# EAGLE design v4MetroKnome (EAGLE 6.1)
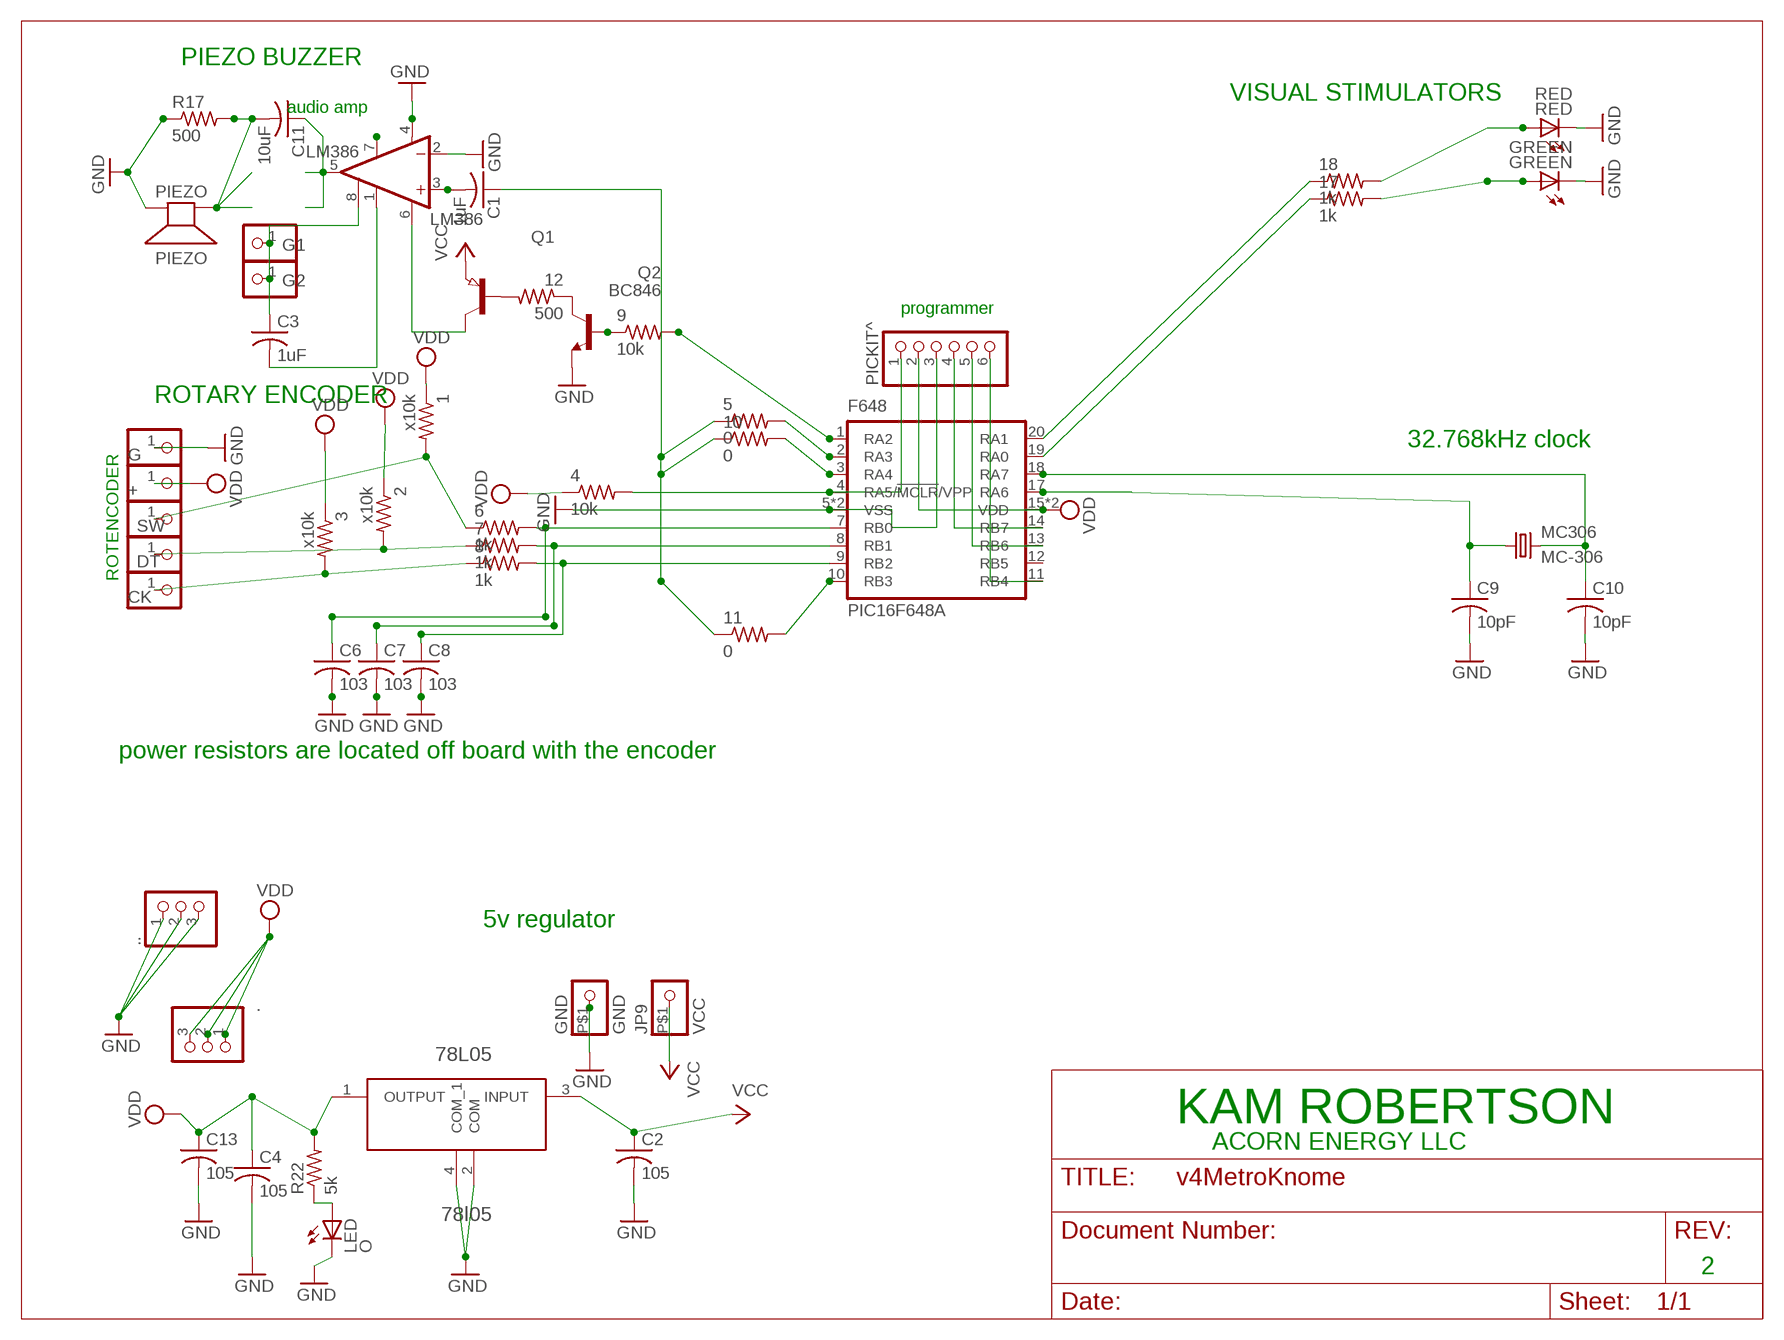
[diagram p0: schematic, sheet 1]

## Parts
1  x10k  R-US_R1206  [R1206]
2  x10k  R-US_R1206  [R1206]
3  x10k  R-US_R1206  [R1206]
4  10k  R-US_R1206  [R1206]
5  0  R-US_R1206  [R1206]
6  1k  R-US_R1206  [R1206]
7  1k  R-US_R1206  [R1206]
8  1k  R-US_R1206  [R1206]
9  10k  R-US_R1206  [R1206]
10  0  R-US_R1206  [R1206]
11  0  R-US_R1206  [R1206]
12  500  R-US_R1206  [R1206]
17  1k  R-US_R1206  [R1206]
18  1k  R-US_R1206  [R1206]
78L05  78l05  UA78L05ACPKG3  [SOT150P400X160-4N]
+  PINHD-1X1CB  [1X01-CLEANBIG]
.  PINHD-1X3CB  [1X03-CLEANBIG]
..  PINHD-1X3CB  [1X03-CLEANBIG]
C1  1uF  C-USC1210  [C1210]
C2  105  C-USC1210  [C1210]
C3  1uF  C-USC1210  [C1210]
C4  105  C-USC1210  [C1210]
C6  103  C-USC1210  [C1210]
C7  103  C-USC1210  [C1210]
C8  103  C-USC1210  [C1210]
C9  10pF  C-USC1210  [C1210]
C10  10pF  C-USC1210  [C1210]
C11  10uF  C-USC1210  [C1210]
C13  105  C-USC1210  [C1210]
CK  PINHD-1X1CB  [1X01-CLEANBIG]
DT  PINHD-1X1CB  [1X01-CLEANBIG]
F648  PIC16F648A  PIC16F1826/27SS  [SSOP20]
G  PINHD-1X1CB  [1X01-CLEANBIG]
G1  PINHD-1X1CB  [1X01-CLEANBIG]
G2  PINHD-1X1CB  [1X01-CLEANBIG]
GND  GND  PINHD-1X1-BIGPOGO  [1X1-BIGPOGO]
GREEN  GREEN  LED5MM  [LED5MM]
JP9  VCC  PINHD-1X1-BIGPOGO  [1X1-BIGPOGO]
LED  O  LEDCHIPLED_1206  [CHIPLED_1206]
LM386  LM386  LM386M-1  [SO08]
MC306  MC-306  [MC-306]
PICKIT^  PINHD-1X6LOCK  [1X06-BIGLOCK]
PIEZO  PIEZO  SPEAKER/PS12  [PS12]
Q1  PNP-TRANSISTOR_SOT89  [SOT89]
Q2  BC846  [SOT23]
R17  500  R-US_R1206  [R1206]
R22  5k  R-US_R1206  [R1206]
RED  RED  LED5MM  [LED5MM]
SW  PINHD-1X1CB  [1X01-CLEANBIG]

## Nets
GND: 78L05.2(COM) 78L05.4(COM_1) ...1 ...2 ...3 C2.2 C4.2 C6.2 C7.2 C8.2 C9.2 C10.2 C13.2 F648.5(VSS) F648.6(VSS) G.1 GND.P$1 GREEN.K(C) LED.C LM386.2(-IN) LM386.4(GND) PICKIT^.3 PIEZO.P$2(-) Q2.2(E) R17.1 RED.K(C)
N$1: 9.2 F648.1(RA2)
N$2: C3.2 LM386.1(GAIN)
N$3: 9.1 Q2.1(B)
N$4: 5.2 F648.2(RA3)
N$5: 4.2 F648.4(RA5/!MCLR!/VPP) PICKIT^.1
N$6: 6.2 C6.1 F648.7(RB0)
N$7: 7.2 C7.1 F648.8(RB1)
N$8: 8.2 C8.1 F648.9(RB2)
N$9: 10.2 F648.3(RA4)
N$10: 11.2 F648.10(RB3)
N$11: 12.1 Q2.3(C)
N$12: 12.2 Q1.1(B)
N$13: C3.1 G1.1 G2.1 LM386.8(GAIN)
N$14: 1.2 6.1 SW.1
N$15: 2.2 7.1 DT.1
N$16: 3.2 8.1 CK.1
N$18: 18.1 F648.20(RA1)
N$19: 17.1 F648.19(RA0)
N$22: F648.14(RB7) PICKIT^.4
N$24: F648.13(RB6) PICKIT^.5
N$27: F648.11(RB4) PICKIT^.6
N$28: 18.2 RED.A
N$29: 17.2 GREEN.A
N$31: C9.1 F648.17(RA6) MC306.1
N$35: C1.2 LM386.3(+IN)
N$36: C11.1 LM386.5(OUT)
N$37: C10.1 F648.18(RA7) MC306.4
N$39: C11.2 PIEZO.P$1(+) R17.2
N$40: LED.A R22.1
N$85: 5.1 10.1 11.1 C1.1
N$102: LM386.7(BYPASS)
VCC: 78L05.3(INPUT) C2.1 JP9.P$1 Q1.3(E)
VDD: 1.1 2.1 3.1 4.1 78L05.1(OUTPUT) +.1 ..1 ..2 ..3 C4.1 C13.1 F648.15(VDD) F648.16(VDD) PICKIT^.2 R22.2
VS: LM386.6(VS) Q1.2(C)
Unconnected: F648.12(RB5)

## Notes on the sheet
- PIEZO BUZZER
- audio amp | VISUAL STIMULATORS
- programmer
- ROTARY ENCODER
- 32.768kHz clock
- ROTENCODER
- power resistors are located off board with the encoder
- 5v regulator
- KAM ROBERTSON
- ACORN ENERGY LLC
- 2

## Library data of the parts
1-12 17 18 R17 R22 = resistor:R-US_: RESISTOR, American symbol
78L05 = TI-Eagle_library:UA78L05: μA78L00 SERIES POSITIVE-VOLTAGE REGULATORS,SOT-89-3; MPN: UA78L05ACPKG3; OC_FARNELL: 1236590; OC_NEWARK: 13M5626; PACKAGE: SOT-89-3; SUPPLIER: TEXAS INSTRUMENTS
+ CK DT G G1 G2 GND JP9 SW = adafruit:PINHD-1X1: Pin header 1x1 for 0.1" spacing With round pins
. .. = adafruit:PINHD-1X3: PIN HEADER
C1-C4 C6-C11 C13 = adafruit:C-US: CAPACITOR, American symbol
F648 = microchip:PIC16*F1826/27: 18/20/28-Pin Flash Microcontrollers with nanoWatt XLP Technology Source: www.microchip.com PIC16F1827.pdf
GREEN LED RED = adafruit:LED: LED OSRAM: - CHIPLED LG R971, LG N971, LY N971, LG Q971, LY Q971, LO R971, LY R971 LH N974, LH R974 LS Q976, LO Q976, LY Q976 LO Q996 - Hyper CHIPLED LW Q18S LB Q993, LB Q99A, LB R99A - SideLED LS A670, LO A670, LY A670, LG A670, LP A670 LB A673, LV A673, LT A673, LW A673 LH A674 LY A675 LS A676, LA A676, LO A676, LY A676, LW A676 LS A679, LY A679, LG A679 - Hyper Micro SIDELED® LS Y876, LA Y876, LO Y876, LY Y876 LT Y87S - SmartLED LW L88C, LW L88S LB L89C, LB L89S, LG L890 LS L89K, LO L89K, LY L89K LS L896, LA L896, LO L896, LY L896 - TOPLED LS T670, LO T670, LY T670, LG T670, LP T670 LSG T670, LSP T670, LSY T670, LOP T670, LYG T670 LG T671, LOG T671, LSG T671 LB T673, LV T673, LT T673, LW T673 LH T674 LS T676, LA T676, LO T676, LY T676, LB T676, LH T676, LSB T676, LW T676 LB T67C, LV T67C, LT T67C, LS T67K, LO T67K, LY T67K, LW E67C LS E67B, LA E67B, LO E67B, LY E67B, LB E67C, LV E67C, LT E67C LW T67C LS T679, LY T679, LG T679 LS T770, LO T770, LY T770, LG T770, LP T770 LB T773, LV T773, LT T773, LW T773 LH T774 LS E675, LA E675, LY E675, LS T675 LS T776, LA T776, LO T776, LY T776, LB T776 LHGB T686 LT T68C, LB T68C - Hyper Mini TOPLED® LB M676 - Mini TOPLED Santana® LG M470 LS M47K, LO M47K, LY M47K Source: http://www.osram.convergy.de/
LM386 = linear:LM386?-*: Low Voltage Audio Power Amplifier Source: http://cache.national.com/ds/LM/LM386.pdf
MC306 = crystal:MC-306: kHz RANGE CRYSTAL UNIT SMD Source: MC-306_405_406_E07X.PDF Homepage <http://www.epsontoyocom.co.jp>; MPN: MC-306 60.0KHZ 100PPM ,12.5PF; OC_FARNELL: 1278040; OC_NEWARK: 31M5576
PICKIT^ = adafruit:PINHD-1X6: PIN HEADER
PIEZO = adafruit:SPEAKER: SPEAKER Source: Buerklin Added PS12 (for part # PS1240 piezo) http://www.ladyada.net/library/pcb/eaglelibrary.html
Q1 = semicon-smd-ipc:PNP-TRANSISTOR_: PNP TRANSISTOR
Q2 = transistor-neu-to92:BC846: NPN TRANSISTOR

## Board
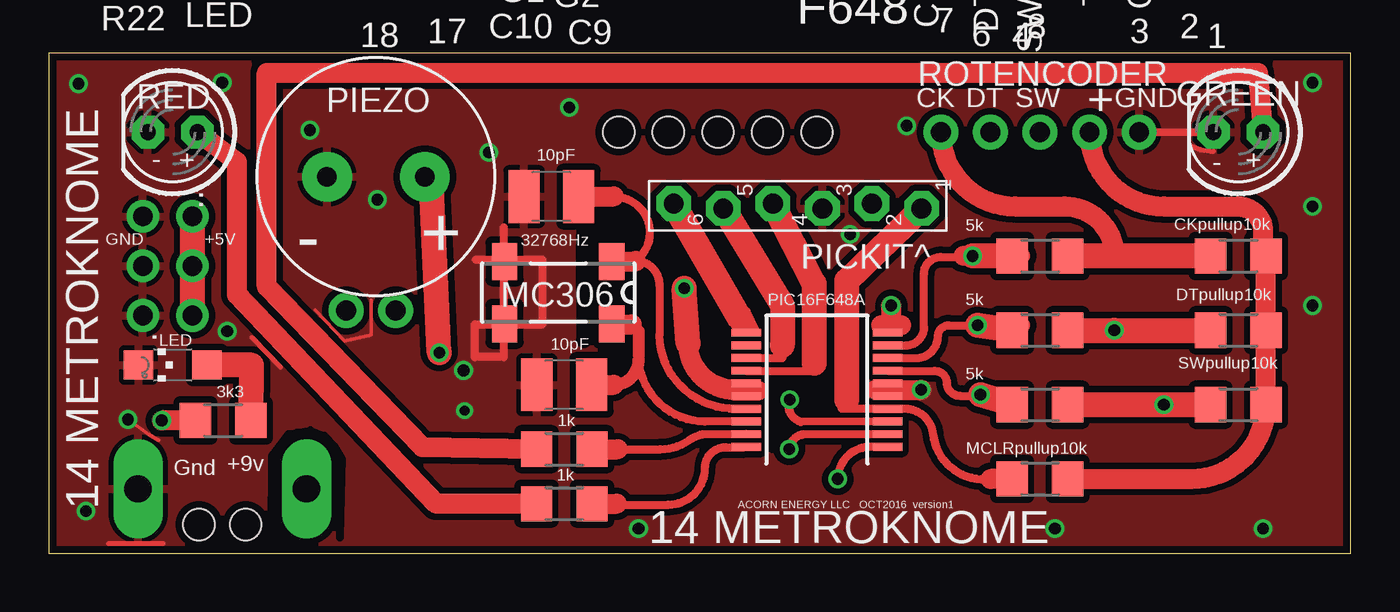
[diagram p1: board, top side]
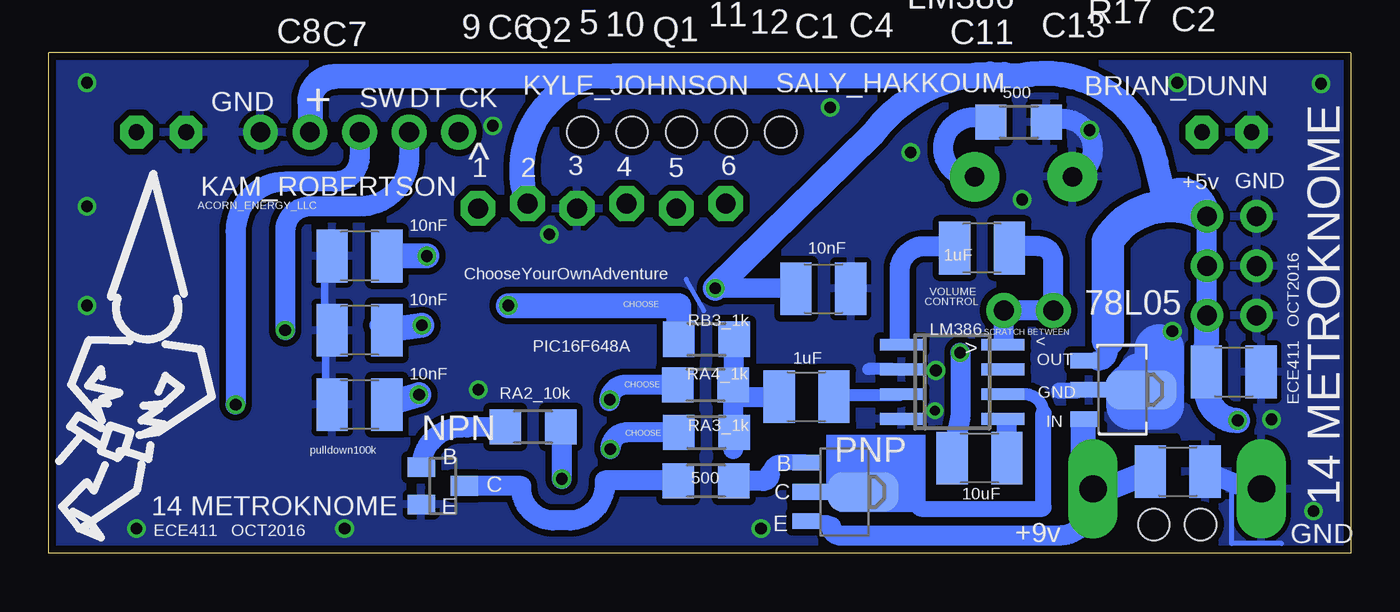
[diagram p2: board, bottom side, seen from below]

Size 66.73 x 25.65 mm. Coordinates in mm from the lower left corner, seen from the top.
Outline: 0,25.64 0,0
Outline: 0.01,0 66.73,0 66.73,25.65 0.01,25.65
Copper layers (1*16): Top 0.0356mm / dielectric 1.5011mm / Bottom 0.0356mm
Design rules: minimum track width 6mil, minimum drill 13mil, track to track 13mil, track to pad 13mil, pad to pad 13mil, via to via 13mil, smd to smd 13mil, copper to edge 15mil, drill to drill 6mil, minimum pad ring 7mil, minimum via ring 7mil, stop-mask expansion 2.5mil, vias tented up to drill 0mil, thermal gap 10mil
Holes 1.6 mm at 10.08,1.47 7.7,1.47 39.37,21.59 36.83,21.59 34.29,21.59 31.75,21.59 29.21,21.59
tRestrict: 14 lines
bRestrict: 5 lines

### Footprints (pad centres in the part's own frame; a part is rotated, then mirrored left to right if it is on the bottom)
R1206 = smd 1.6 x 1.803: 1 -1.422,0; 2 1.422,0
SOT150P400X160-4N = smd 0.8 x 1.4: 1 -1.499,-1.981; 3 1.499,-1.981 | smd 0.8 x 1.9: 2 0,-1.727 | smd 2.032 x 3.65: 4 0,0.94
1X01-CLEANBIG = drill 1.016 pad 1.778: 1 0,0
1X03-CLEANBIG = drill 1.016 pad 1.676: 1 -2.54,0; 2 0,0; 3 2.54,0
C1210 = smd 1.6 x 2.7: 1 -1.4,0; 2 1.4,0
SSOP20 = smd 0.4 x 1.5: 1 -2.925,-3.625; 2 -2.275,-3.625; 3 -1.625,-3.625; 4 -0.975,-3.625; 5 -0.325,-3.625; 6 0.325,-3.625; 7 0.975,-3.625; 8 1.625,-3.625; 9 2.275,-3.625; 10 2.925,-3.625; 11 2.925,3.625; 12 2.275,3.625; 13 1.625,3.625; 14 0.975,3.625; 15 0.325,3.625; 16 -0.325,3.625; 17 -0.975,3.625; 18 -1.625,3.625; 19 -2.275,3.625; 20 -2.925,3.625
1X1-BIGPOGO = drill 1.4 pad 2.54 long: P$1 0,0
LED5MM = drill 0.813 pad 1.676 octagon: A -1.27,0; K 1.27,0
CHIPLED_1206 = smd 1.5 x 1.5: A 0,-1.75; C 0,1.75
SO08 = smd 0.6 x 2.2: 1 -1.905,-2.6; 2 -0.635,-2.6; 3 0.635,-2.6; 4 1.905,-2.6; 5 1.905,2.6; 6 0.635,2.6; 7 -0.635,2.6; 8 -1.905,2.6
MC-306 = smd 1.3 x 1.9: 1 -2.75,-1.6; 2 2.75,-1.6; 3 2.75,1.6; 4 -2.75,1.6
1X06-BIGLOCK = drill 1.016 pad 1.778 octagon: 1 -6.35,0.127; 2 -3.81,-0.127; 3 -1.27,0.127; 4 1.27,-0.127; 5 3.81,0.127; 6 6.35,-0.127
PS12 = drill 1 pad 2.54: P$1 -2.5,0; P$2 2.5,0
SOT89 = smd 0.8 x 1.4: 1 -1.499,-1.981; 3 1.499,-1.981 | smd 0.8 x 1.9: 2 0,-1.727 | smd 2.032 x 3.65: 2@1 0,0.94
SOT23 = smd 1 x 1.4: 1 -0.95,-1.1; 2 0.95,-1.1; 3 0,1.1

### Placement (x,y rotation side)
1  60.96,7.62 180 top
2  60.96,11.43 180 top
3  60.96,15.24 180 top
4  50.8,3.81 180 top
5  33.02,6.2 180 bottom
6  50.8,7.62 180 top
7  50.8,11.43 180 top
8  50.8,15.24 180 top
9  41.91,6.48 0 bottom
10  33.07,8.64 180 bottom
11  33.02,10.97 180 bottom
12  33.05,3.71 0 bottom
17  26.42,5.33 180 top
18  26.42,2.54 180 top
78L05  11.68,8.38 270 bottom
+  53.34,21.59 90 top
.  7.37,14.73 90 top
..  4.83,14.73 270 top
C1  27.89,8.03 0 bottom
C2  8.86,4.19 0 bottom
C3  18.9,15.65 180 bottom
C4  27.03,13.56 0 bottom
C6  50.8,7.62 180 bottom
C7  50.8,11.43 180 bottom
C8  50.8,15.24 180 bottom
C9  25.76,18.29 180 top
C10  26.42,8.64 180 top
C11  19.02,4.88 180 bottom
C13  5.99,9.3 0 bottom
CK  45.72,21.59 90 top
DT  48.26,21.59 90 top
F648  39.37,8.38 90 top
G  55.88,21.59 90 top
G1  15.24,12.45 0 top
G2  17.78,12.45 0 top
GND  4.57,3.3 270 bottom
GREEN  60.96,21.59 180 top
JP9  13.21,3.3 90 bottom
LED  6.35,9.65 90 top
LM386  20.42,8.79 270 bottom
MC306  26.11,13.36 180 top
PICKIT^  38.38,17.81 180 top
PIEZO  16.76,19.3 180 top
Q1  25.93,3.15 270 bottom
Q2  46.53,3.45 270 bottom
R17  17.02,22.1 180 bottom
R22  8.94,6.81 180 top
RED  6.35,21.59 180 top
SW  50.8,21.59 90 top

### Tracks (layer width: path | path; a pad name or v marks a point on that pad's centre or on a via)
GND  (via drill 0.5, 0.6)
  Top 0.178: 5.64,5.79 5.13,6.1 v4.06,6.86 | 13.64,12.47 15.16,10.87 16.51,11.2 16.51,12.98
  Top 0.254: 10.41,11.05 11.86,9.55 | 58.5,20.9 59.03,20.7 59.69,20.6 | 3.05,0.51 5.84,0.51
  Top 0.381: G.1 GREEN.K | F648.5 43,8.08 43,8.69 F648.6
  Top 0.406: F648.5 42.99,8.38 42.42,8.38 | 23.32,16.71 23.32,10.06 21.84,10.06 21.84,11.73 25.3,11.73 25.3,15.04 21.89,15.04
  Top 1.016: 42.42,8.38 v44.7,8.38
  Bottom 0.254: 33.15,12.45 34.06,14.05 | 3.56,0.51 6.1,0.51 6.1,3.3
  Bottom 0.381: C6.2 52.53,8.28 52.53,11.68 C7.2 52.58,11.84 52.58,15.24 C8.2
  Bottom 0.61: 23.47,9.45 24.74,9.45
  Bottom 0.813: 14.07,8.38 14.07,8.33 14.94,8.33
  Bottom 1.016: 13.66,19.61 arc-169 15.65,22 arc249 15.65,22.1 arc-69 R17.1 | C2.2 4.57,3.05 GND.P$1
  Bottom 2.54: 9.8,10.46 9.8,7.59 11.28,7.59 11.28,8.48 10.74,8.48 10.74,9.02
  other vias: 8.89,24.13 16.84,18.14 22.56,20.55 41.07,16.36 64.77,12.7 51.56,1.27 62.23,1.27 64.77,24.13 64.77,17.78 1.52,24.08 1.91,2.16 21.31,7.32 43.97,21.92 26.67,22.86 30.23,1.27 21.26,9.37 13.39,21.69 9.14,11.38
  pour Top: 3.2,0.46 3.2,25.04 63.65,25.04 63.65,0.46
  pour Bottom: -0.15,25.45 66.6,25.45 66.6,-0.15 0.1,-0.15
  pour Top: 0.1,25.55 66.75,25.6 66.65,0.25 0.2,0.2
N$1  (via drill 0.6)
  Top 0.406: F648.1 42.13,5.46 arc90 v40.44,3.81
  Bottom 1.016: 9.2 40.44,6.48 v40.44,3.81
N$2
  Bottom 0.406: LM386.1 23.11,10.92
  Bottom 1.016: 23.11,10.92 23.11,14.48 arc90 21.84,15.75 20.57,15.75 arc90 20.32,15.49 | 20.32,15.49 20.32,15.75 | C3.2 20.3,15.52 arc90 20.32,15.49
N$3
  Bottom 1.016: 9.1 45.28,6.45 45.59,6.45 arc-90 Q2.1
N$4  (via drill 0.6)
  Top 0.381: 42.98,6.1 F648.2
  Top 0.406: 42.98,6.1 38.86,6.1 arc90 v37.95,5.33
  Bottom 1.016: 5.2 37.08,6.2 arc-90 v37.95,5.33
N$5
  Top 0.406: 40.89,7.87 40.64,7.41 F648.4 43.75,7.41 arc-90 45.31,6.1 arc90 48.26,3.81
  Top 1.016: 4.2 48.26,3.81
  Top 1.27: PICKIT^.1 40.89,13.97 40.89,7.87
N$6  (via drill 0.6)
  Top 0.406: v47.75,8.13 47.75,8.08 46.69,8.08 arc-90 46.02,8.74 arc90 45.41,9.35 43.01,9.35 arc-90 F648.7
  Top 1.27: 6.2 v47.75,8.13
  Bottom 1.27: v47.75,8.13 C6.1
N$7  (via drill 0.6)
  Top 0.406: F648.8 44.45,10.01 arc90 45.57,11.12 arc-90 46.13,11.68 v47.6,11.68
  Top 0.813: 49.89,11.68 7.2
  Top 1.27: 7.2 v47.6,11.68
  Bottom 0.813: C7.1 49.89,11.68
  Bottom 1.27: v47.6,11.68 C7.1
N$8  (via drill 0.6)
  Top 0.406: F648.9 43.93,10.66 arc90 44.86,11.58 44.86,14.33 arc-90 45.72,15.19 47.35,15.19 v47.35,15.24
  Top 0.813: 49.89,15.24 8.2
  Top 1.016: v47.35,15.24 46.89,15.24
  Top 1.27: 8.2 v47.35,15.24
  Bottom 1.27: v47.35,15.24 C8.1
N$9  (via drill 0.6)
  Top 0.406: F648.3 38.53,6.73 arc-90 v37.97,7.87
  Bottom 1.016: 10.2 37.16,8.64 arc-90 38,7.8 38,7.82 | 38,7.82 arc90 37.97,7.85 arc90 38,7.82 | 38,7.82 38,7.85 arc90 v37.97,7.87
N$10  (via drill 0.6)
  Top 0.406: F648.10 42.93,11.31 42.93,11.68
  Top 1.016: 42.67,11.68 42.93,11.68 43.18,11.68 | 43.69,11.68 43.18,11.68 | 43.18,11.68 v43.18,12.7
  Bottom 1.27: v43.18,12.7 34.44,12.7 11.2
N$11
  Bottom 1.016: 12.1 34.47,3.73 38.23,3.73 38.23,3.61 arc90 40.01,1.68 40.89,1.68 arc90 42.52,3.45 Q2.3
N$12
  Bottom 0.813: Q1.1 29.18,4.65 arc-90 29.77,4.06
  Bottom 1.016: 29.77,4.06 arc90 30.12,3.71 12.2
N$13
  Bottom 0.406: LM386.8 17.78,10.69 17.78,10.92
  Bottom 1.016: C3.1 arc90 17.4,15.75 16,15.75 arc90 15.24,14.99 G1.1 G2.1 17.78,10.92
N$14  (via drill 0.6)
  Top 1.27: 6.1 v57.15,7.62 1.2
  Bottom 1.016: SW.1 50.8,20.32 arc90 52.07,19.05 54.61,19.05 arc-90 57.15,16.51 v57.15,7.62
N$15  (via drill 0.6)
  Top 1.27: 7.1 v54.61,11.43 2.2
  Bottom 1.016: v54.61,11.43 54.61,16.51 arc90 53.34,17.78 50.8,17.78 arc-90 48.26,20.32 DT.1
N$16
  Top 0.381: 8.1 52.63,15.24 52.68,15.24
  Top 0.813: 54.61,15.24 52.63,15.24
  Top 1.016: CK.1 arc90 49.53,17.78 52.07,17.78 arc-90 54.61,15.24
  Top 1.27: 3.2 55.98,15.24 54.61,15.24 52.68,15.24
N$18
  Top 0.406: 35.76,5.44 35.66,5.44 | 35.66,5.44 arc-90 35.68,5.46 F648.20 | 29.11,2.54 29.11,2.49 31.75,2.49 arc90 33.63,4.37 arc-90 34.7,5.44 35.66,5.44
  Top 1.016: 18.1 29.11,2.54
N$19
  Top 0.406: 35.76,6.1 arc90 35.75,6.11 F648.19 33.54,6.11 arc90 33.53,6.1 arc30 32.82,5.79 arc-34 31.34,5.33 29.16,5.33
  Top 1.016: 17.1 29.16,5.33
N$22
  Top 0.178: 39.22,9.75 39.12,9.36
  Top 0.406: F648.14 39.12,9.36
  Top 1.27: PICKIT^.4 39.22,13.82 39.22,9.75
N$24
  Top 0.406: F648.13 37.59,10.01 37.59,10.67
  Top 1.27: PICKIT^.5 37.59,12.7 37.59,10.67
N$27
  Top 0.406: F648.11 35.81,11.31 | 35.81,11.31 35.46,11.99 | 35.76,12.39 36.22,11.43 35.94,11.57 | 35.94,11.57 35.81,11.63 | 35.81,11.31 35.94,11.31 35.94,11.57
  Top 1.27: 35.46,11.99 PICKIT^.6
N$28
  Top 1.016: 18.2 19.86,2.54 9.65,13.26 9.65,20.07 RED.A
N$29
  Top 1.016: 17.2 19.15,5.44 11.18,13.66 11.18,24.64 61.98,24.64 GREEN.A
N$31
  Top 0.406: F648.17 35.27,7.41 arc-90 31.29,11.18 31.29,13.77 arc90 30.07,14.99 arc143 28.96,18.29
  Top 1.016: MC306.1 30.07,14.96 30.07,14.99 | C9.1 28.96,18.29
N$35
  Bottom 0.381: 26.62,8.13 26.62,8.03 C1.2 | 23.06,8.13 LM386.3
  Bottom 0.61: 26.62,8.13 23.06,8.13
N$36
  Bottom 0.381: 17.63,6.6 LM386.5 | 17.63,4.78 C11.1
  Bottom 1.016: 17.63,4.78 17.63,6.6
N$37
  Top 0.406: F648.18 33.63,6.76 arc-90 30.23,10.16 arc4 30.23,9.96 | 29.87,11.73 arc-90 30.23,11.38
  Top 0.61: 30.23,11.38 30.23,10.16 | 28.96,8.64 arc92 30.23,9.96
  Top 1.016: MC306.4 arc90 28.89,11.73 29.87,11.73 | C10.1 28.96,8.64
N$39  (via drill 0.6)
  Top 0.178: 19.51,18.75 PIEZO.P$1
  Top 1.27: v20.02,10.29 19.61,18.75 19.51,18.75
  Bottom 0.381: 19.51,18.8 PIEZO.P$1 19.61,18.64 | R17.2
  Bottom 0.61: 20.47,4.93 C11.2
  Bottom 1.016: PIEZO.P$1 19.56,18.8 20.42,19.66 arc168 R17.2 | v20.02,10.29 20.02,6.99 20.47,4.93
N$40
  Top 1.27: R22.1 10.39,9.65 LED.A
N$85
  Bottom 0.381: 31.6,10.41 11.1 | 31.6,8.03 10.1
  Bottom 1.016: 31.65,5.33 5.1 10.1 | 31.6,8.03 | 31.6,8.03 11.1 | 31.6,8.03 29.44,8.03 29.44,7.95 29.29,7.95 C1.1
VCC
  Bottom 0.381: 13.16,3.05 JP9.P$1 13.31,3.45 13.72,3.45
  Bottom 0.406: 13.66,6.6 13.72,6.6
  Bottom 0.61: 78L05.3 13.66,6.6 | Q1.3 26.9,1.65 arc90 26.62,1.37
  Bottom 1.016: 26.62,1.37 arc-90 26.16,0.91 14.96,0.91 arc-90 13.21,2.67 JP9.P$1
  Bottom 1.27: 13.72,6.6 13.72,3.45 13.72,3.3 | 13.16,3.05 C2.1
VDD  (via drill 0.6)
  Top 0.406: F648.16 arc-90 36.07,8.38 36.22,8.38 arc90 35.9,8.71 F648.15 arc90 36.12,8.33 36.32,8.33
  Top 1.016: R22.2 v5.79,6.81 | 36.32,8.33 35.15,8.33 35.15,8.38 arc-90 32.77,10.77 | +.1 arc90 57.15,17.78 60.96,17.78 arc-90 62.23,16.51 62.23,15.24 3.1 2.1 1.1 arc-90 58.57,3.81 4.1
  Top 1.27: 32.77,10.77 v32.56,13.59 | 7.37,12.17 ..3
  Bottom 0.254: 8.64,18.59 arc90 8.66,18.57 8.69,18.57 8.69,18.59 | 8.94,18.59 arc-90 8.97,18.62 9.5,18.62
  Bottom 0.61: 78L05.1 13.72,9.88
  Bottom 0.813: 78L05.1 12.95,9.88
  Bottom 1.016: v5.79,6.81 5.74,6.81 | C13.1 7.39,8.41 | ..1 ..2 ..3 | 39.07,24.46 37.85,24.46 | C4.1 v32.56,13.59 | 12.95,9.88 arc-90 12.45,10.39 12.45,10.92
  Bottom 1.27: C13.1 ..1 | 7.39,8.41 arc-90 v5.79,6.81 | 17.07,24.45 16.94,24.46 arc90 9.98,20.04 9.68,18.8 arc-90 9.5,18.62 | 17.07,24.45 37.85,24.46 52.07,24.43 arc-90 53.34,23.16 +.1 | PICKIT^.2 arc90 39.07,24.46 | v32.56,13.59 24.51,21.49 arc63 17.07,24.45 | ..3 arc-90 8.69,18.59 8.94,18.59 | 8.48,18.59 8.64,18.59
  Bottom 1.676: 12.45,10.92 12.45,16 arc90 ..3
VS
  Bottom 0.61: 15.75,7.19 arc-90 16.71,8.15 LM386.6
  Bottom 0.813: Q1.2 22.84,3.15 arc90 22.17,2.49 arc-90 21.97,2.29 15.82,2.29 arc-90 15.75,2.36 15.75,7.19
(copper drawn outside any net)
  shapes: Bottom area x2

### Text on the board
tPlace: ROTENCODER | + | 14 METROKNOME | CK | DT | SW | GND | - | + | 10pF | - | + | 1 | 5 | 3 | 6 | 4 | 2 | 5k | CKpullup10k | GND | +5V | 32768Hz | - | + | PIC16F648A | 5k | DTpullup10k | LED | 10pF | 5k | SWpullup10k | 3k3 | 1k | MCLRpullup10k | Gnd | +9v | 1k | ACORN ENERGY LLC OCT2016 version1 | 14 METROKNOME
bPlace: SALY_HAKKOUM | + | GND | 14 METROKNOME | BRIAN_DUNN | 500 | KYLE_JOHNSON | CK | DT | SW | GND | +5v | 6 | 5 | 4 | 3 | 2 | 1 | ^ | KAM_ROBERTSON | ACORN_ENERGY_LLC | 10nF | 1uF | 10nF | ChooseYourOwnAdventure | VOLUME | CONTROL | CHOOSE | 10nF | RB3_1k | < | SCRATCH BETWEEN | LM386 | OUT | > | 1uF | PIC16F648A | RA4_1k | 10nF | ECE411 OCT2016 | GND | CHOOSE | RA2_10k | IN | RA3_1k | CHOOSE | NPN | PNP | B | pulldown100k | B | 500 | 10uF | C | C | E | 14 METROKNOME | GND | +9v | E | ECE411 OCT2016
Notes: HERBERT_THE_ROOSTER